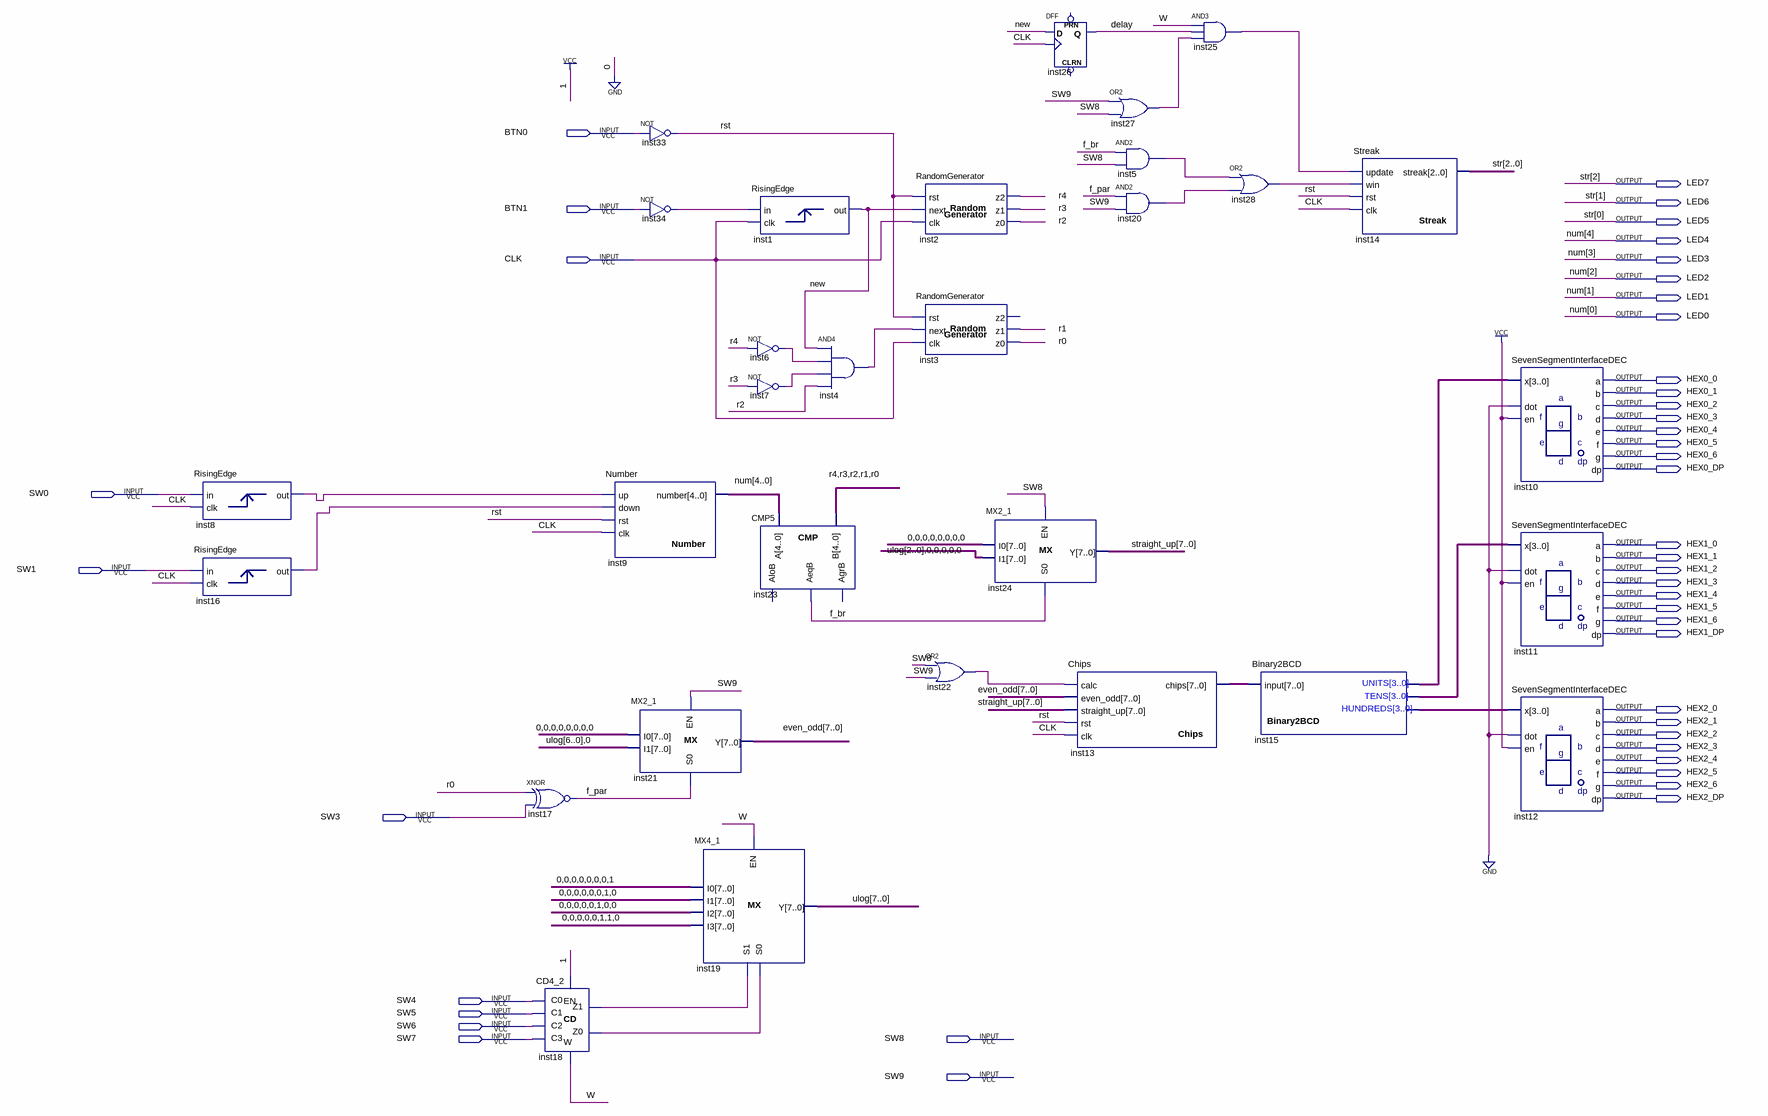
[diagram p0: schematic sheet]
// Quartus schematic PORT_LAB4.bdf as structural Verilog: 30 symbols, 44 pins
module PORT_LAB4 (
  input  BTN0,
  input  BTN1,
  input  CLK,
  input  SW0,
  input  SW1,
  input  SW3,
  input  SW4,
  input  SW5,
  input  SW6,
  input  SW7,
  input  SW8,
  input  SW9,
  output LED7,
  output LED6,
  output LED5,
  output LED4,
  output LED3,
  output LED2,
  output LED1,
  output LED0,
  output HEX0_0,
  output HEX0_1,
  output HEX0_2,
  output HEX0_3,
  output HEX0_4,
  output HEX0_5,
  output HEX0_6,
  output HEX0_DP,
  output HEX1_0,
  output HEX1_1,
  output HEX1_2,
  output HEX1_3,
  output HEX1_4,
  output HEX1_5,
  output HEX1_6,
  output HEX1_DP,
  output HEX2_0,
  output HEX2_1,
  output HEX2_2,
  output HEX2_3,
  output HEX2_4,
  output HEX2_5,
  output HEX2_6,
  output HEX2_DP
);

  wire delay, f_br, f_par, inst4_out, inst5_out, inst6_out, inst7_out, inst8_output, inst16_output,
       inst18_z0, inst18_z1, inst20_out, inst22_out, inst25_out, inst27_out, inst28_out, inst34_out, \new ,
       r0, r1, r2, r3, r4, rst, W;
  wire [3:0] inst15_bcd_hundreds, inst15_bcd_tens, inst15_bcd_units;
  wire [7:0] even_odd, inst13_chips, straight_up, ulog;

  RisingEdge inst8 (.clk(CLK), .\input (SW0), .\output (inst8_output));
  RisingEdge inst16 (.clk(CLK), .\input (SW1), .\output (inst16_output));
  xnor inst17 (f_par, r0, SW3);
  CD4_2 inst18 (.C0(SW4), .C1(SW5), .C2(SW6), .C3(SW7), .EN(1'b1), .Z0(inst18_z0), .Z1(inst18_z1), .W(W));
  not inst33 (rst, BTN0);
  not inst34 (inst34_out, BTN1);
  Number inst9 (.up(inst8_output), .down(inst16_output), .rst(rst), .clk(CLK), .number({LED4, LED3, LED2, LED1, LED0}));
  MX2_1 inst21 (.I1({ulog[6:0], 1'b0}), .I0({8{1'b0}}), .S0(f_par), .EN(SW9), .Y(even_odd));
  MX4_1 inst19 (
    .I3(8'b00000110), .I2(8'b00000100), .I1(8'b00000010), .I0(8'b00000001), .S1(inst18_z1), .S0(inst18_z0),
    .EN(W), .Y(ulog));
  RisingEdge inst1 (.clk(CLK), .\input (inst34_out), .\output (\new ));
  not inst6 (inst6_out, r4);
  not inst7 (inst7_out, r3);
  CMP5 inst23 (.A({LED4, LED3, LED2, LED1, LED0}), .B({r4, r3, r2, r1, r0}), .AeqB(f_br));  // open: AgrB, AloB
  and inst4 (inst4_out, \new , inst6_out, inst7_out, r2);
  RandomGenerator inst2 (.NXT(\new ), .RST(rst), .CLK(CLK), .Z2(r4), .Z1(r3), .Z0(r2));
  RandomGenerator inst3 (.NXT(inst4_out), .RST(rst), .CLK(CLK), .Z1(r1), .Z0(r0));  // open: Z2
  or inst22 (inst22_out, SW8, SW9);
  MX2_1 inst24 (.I1({ulog[2:0], {5{1'b0}}}), .I0({8{1'b0}}), .S0(f_br), .EN(SW8), .Y(straight_up));
  DFF inst26 (.CLK(CLK), .D(\new ), .Q(delay));  // open: CLRN, PRN
  Chips inst13 (
    .calc(inst22_out), .even_odd(even_odd), .straight_up(straight_up), .rst(rst), .clk(CLK),
    .chips(inst13_chips));
  or inst27 (inst27_out, SW9, SW8);
  and inst5 (inst5_out, f_br, SW8);
  and inst20 (inst20_out, f_par, SW9);
  and inst25 (inst25_out, W, delay, inst27_out);
  or inst28 (inst28_out, inst5_out, inst20_out);
  Binary2BCD inst15 (
    .\input (inst13_chips), .bcd_hundreds(inst15_bcd_hundreds), .bcd_tens(inst15_bcd_tens),
    .bcd_units(inst15_bcd_units));
  Streak inst14 (.update(inst25_out), .win(inst28_out), .rst(rst), .clk(CLK), .streak({LED7, LED6, LED5}));
  SevenSegmentInterfaceDEC inst10 (
    .dot(1'b0), .en(1'b1), .x(inst15_bcd_units), .a(HEX0_0), .b(HEX0_1), .c(HEX0_2), .d(HEX0_3), .e(HEX0_4),
    .f(HEX0_5), .g(HEX0_6), .dp(HEX0_DP));
  SevenSegmentInterfaceDEC inst11 (
    .dot(1'b0), .en(1'b1), .x(inst15_bcd_tens), .a(HEX1_0), .b(HEX1_1), .c(HEX1_2), .d(HEX1_3), .e(HEX1_4),
    .f(HEX1_5), .g(HEX1_6), .dp(HEX1_DP));
  SevenSegmentInterfaceDEC inst12 (
    .dot(1'b0), .en(1'b1), .x(inst15_bcd_hundreds), .a(HEX2_0), .b(HEX2_1), .c(HEX2_2), .d(HEX2_3),
    .e(HEX2_4), .f(HEX2_5), .g(HEX2_6), .dp(HEX2_DP));

  // Other names for the same wires on the sheet: num[4:0] = {LED4, LED3, LED2, LED1, LED0};
  //   str[2:0] = {LED7, LED6, LED5}
endmodule
